# Altium schematic sheet ИМ 1301.10A.01.400_1.SchDoc
size 594 x 420 mm; ApprovedBy: Гришин; CheckedBy: Недвецкий; Author: Буй; Address1: Address1; Address2: Address2; Address3: Address3; Address4: Address4; DocumentNumber: ИМ 1301.10A.01.400 Э3; SheetNumber: 1; SheetTotal: 4; DocumentType: Схема электрическая принципиальная; T_cont: Варенов; Letter: Э
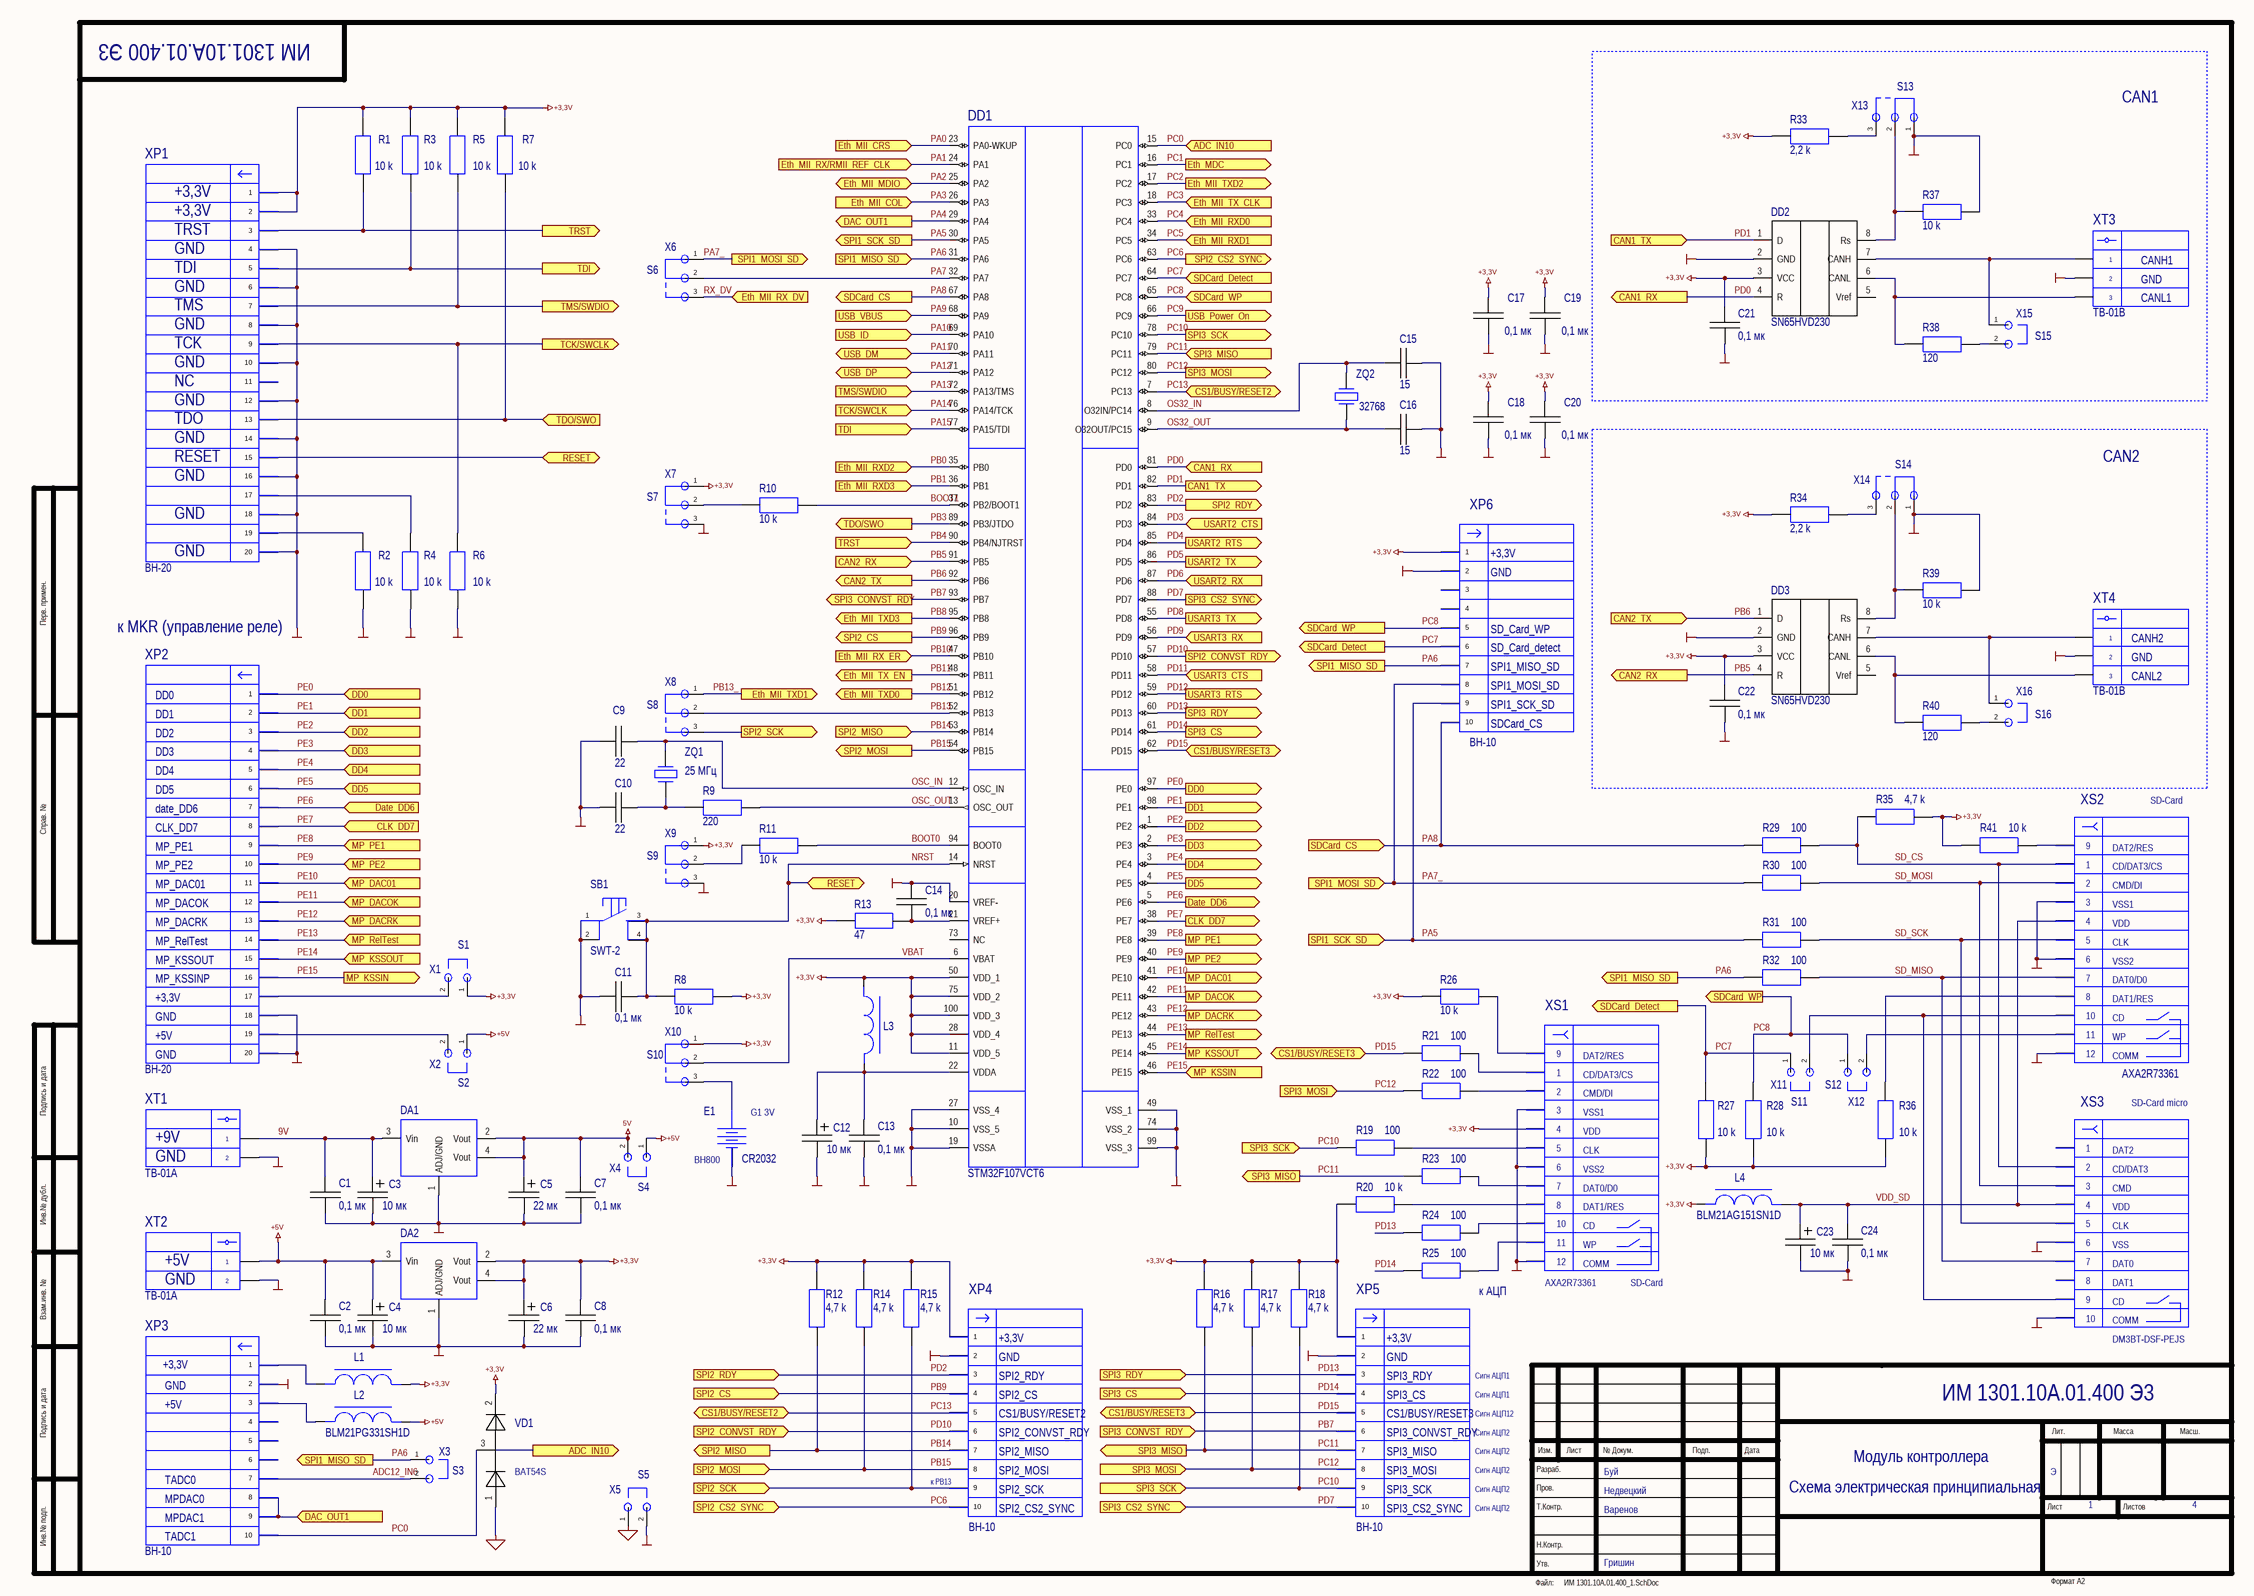
[diagram p0: ИМ 1301.10A.01.400_1.SchDoc]

## Parts
C1  0,1 мк  [CAPC_1206]
C2  0,1 мк  [CAPC_1206]
C3  10 мк  [3216]
C4  10 мк  [3216]
C5  22 мк  [3216]
C6  22 мк  [3216]
C7  0,1 мк  [CAPC_1206]
C8  0,1 мк  [CAPC_1206]
C9  22  [CAPC_1206]
C10  22  [CAPC_1206]
C11  0,1 мк  [CAPC_1206]
C12  10 мк  [3216]
C13  0,1 мк  [CAPC_1206]
C14  0,1 мк  [CAPC_1206]
C15  15  [CAPC_1206]
C16  15  [CAPC_1206]
C17  0,1 мк  [CAPC_1206]
C18  0,1 мк  [CAPC_1206]
C19  0,1 мк  [CAPC_1206]
C20  0,1 мк  [CAPC_1206]
C21  0,1 мк  [CAPC_1206]
C22  0,1 мк  [CAPC_1206]
C23  10 мк  [3216]
C24  0,1 мк  [CAPC_1206]
DA1  LM1117  [SOT223]  (value not drawn)
DA2  LM1117  [SOT223]  (value not drawn)
DD1  STM32F107VCT6  [LQFP100]
DD2  SN65HVD230  [SO8]
DD3  SN65HVD230  [SO8]
E1  BH800  value CR2032  G: G1 3V  [BATTERY_20mm]
L1  BLM21PG331SH1D  [C0805]  (value not drawn)
L2  BLM21PG331SH1D  [C0805]
L3  BLM21AG151SN1D  [C0805]  (value not drawn)
L4  BLM21AG151SN1D  [C0805]
R1  10 k  [SMD_1206]
R2  10 k  [SMD_1206]
R3  10 k  [SMD_1206]
R4  10 k  [SMD_1206]
R5  10 k  [SMD_1206]
R6  10 k  [SMD_1206]
R7  10 k  [SMD_1206]
R8  10 k  [SMD_1206]
R9  220  [SMD_1206]
R10  10 k  [SMD_1206]
R11  10 k  [SMD_1206]
R12  4,7 k  [SMD_1206]
R13  47  [SMD_1206]
R14  4,7 k  [SMD_1206]
R15  4,7 k  [SMD_1206]
R16  4,7 k  [SMD_1206]
R17  4,7 k  [SMD_1206]
R18  4,7 k  [SMD_1206]
R19  100  [SMD_1206]
R20  10 k  [SMD_1206]
R21  100  [SMD_1206]
R22  100  [SMD_1206]
R23  100  [SMD_1206]
R24  100  [SMD_1206]
R25  100  [SMD_1206]
R26  10 k  [SMD_1206]
R27  10 k  [SMD_1206]
R28  10 k  [SMD_1206]
R29  100  [SMD_1206]
R30  100  [SMD_1206]
R31  100  [SMD_1206]
R32  100  [SMD_1206]
R33  2,2 k  [SMD_1206]
R34  2,2 k  [SMD_1206]
R35  4,7 k  [SMD_1206]
R36  10 k  [SMD_1206]
R37  10 k  [SMD_1206]
R38  120  [SMD_1206]
R39  10 k  [SMD_1206]
R40  120  [SMD_1206]
R41  10 k  [SMD_1206]
SB1  SWT-2  [SWT2]
VD1  BAT54S  [SOT23]
X1  Jamper: S1  [PLS-2]  (hidden comment: PLS-02)
X2  Jamper: S2  [PLS-2]  (hidden comment: PLS-02)
X3  Jamper: S3  [PLS-2]  (hidden comment: PLS-02)
X4  Jamper: S4  [PLS-2]  (hidden comment: PLS-02)
X5  Jamper: S5  [PLS-2]  (hidden comment: PLS-02)
X6  Jamper: S6  [PLS-3]  (hidden comment: PLS-03)
X7  Jamper: S7  [PLS-3]  (hidden comment: PLS-03)
X8  Jamper: S8  [PLS-3]  (hidden comment: PLS-03)
X9  Jamper: S9  [PLS-3]  (hidden comment: PLS-03)
X10  Jamper: S10  [PLS-3]  (hidden comment: PLS-03)
X11  Jamper: S11  [PLS-2]  (hidden comment: PLS-02)
X12  Jamper: S12  [PLS-2]  (hidden comment: PLS-02)
X13  Jamper: S13  [PLS-3]  (hidden comment: PLS-03)
X14  Jamper: S14  [PLS-3]  (hidden comment: PLS-03)
X15  Jamper: S15  [PLS-2]  (hidden comment: PLS-02)
X16  Jamper: S16  [PLS-2]  (hidden comment: PLS-02)
XP1  BH-20  [PLD-20]
XP2  BH-20  [PLD-20]
XP3  BH-10  [PLD-10]
XP4  BH-10  [PLD-10]
XP5  BH-10  [PLD-10]
XP6  BH-10  [PLD-10]
XS1  AXA2R73361  Function: SD-Card  [SD_AXA2R]
XS2  AXA2R73361  Function: SD-Card  [SD_AXA2R]
XS3  DM3BT-DSF-PEJS  Function: SD-Card micro  [DM3BT-DSF-PEJS]
XT1  TB-01A  [TB-01A]
XT2  TB-01A  [TB-01A]
XT3  TB-01B  [TB-01B]
XT4  TB-01B  [TB-01B]
ZQ1  25 МГц  [HC-49U_5mm]
ZQ2  32768  [DT-38P]

## Blocks framed on the sheet
CAN1: C21 DD2 R33 R37 R38 X13 X15 XT3
CAN2: C22 DD3 R34 R39 R40 X14 X16 XT4

## Ports
ADC_IN10 (in), ADC_IN10 (out), CAN1_RX (in), CAN1_RX (out), CAN1_TX (in), CAN1_TX (out), CAN2_RX (in), CAN2_RX (out), CAN2_TX (in), CAN2_TX (out), CLK_DD7 (in), CLK_DD7 (out), CS1/BUSY/RESET2 (bidir), CS1/BUSY/RESET3 (bidir), DAC_OUT1 (in), DAC_OUT1 (out), Date_DD6 (in), Date_DD6 (out), DD0 (in), DD0 (out), DD1 (in), DD1 (out), DD2 (in), DD2 (out), DD3 (in), DD3 (out), DD4 (in), DD4 (out), DD5 (in), DD5 (out), Eth_MDC (out), Eth_MII_COL (in), Eth_MII_CRS (in), Eth_MII_MDIO (bidir), Eth_MII_RX/RMII_REF_CLK (in), Eth_MII_RX_DV (in), Eth_MII_RX_ER (in), Eth_MII_RXD0 (in), Eth_MII_RXD1 (in), Eth_MII_RXD2 (in), Eth_MII_RXD3 (in), Eth_MII_TX_CLK (in), Eth_MII_TX_EN (out), Eth_MII_TXD0 (out), Eth_MII_TXD1 (out), Eth_MII_TXD2 (out), Eth_MII_TXD3 (out), MP_DAC01 (in), MP_DAC01 (out), MP_DACOK (in), MP_DACOK (out), MP_DACRK (in), MP_DACRK (out), MP_KSSIN (in), MP_KSSIN (out), MP_KSSOUT (in), MP_KSSOUT (out), MP_PE1 (in), MP_PE1 (out), MP_PE2 (in), MP_PE2 (out), MP_RelTest (in), MP_RelTest (out), RESET (bidir), SDCard_CS (in), SDCard_CS (out), SDCard_Detect (in), SDCard_Detect (out), SDCard_WP (in), SDCard_WP (out), SPI1_MISO_SD (in), SPI1_MISO_SD (out), SPI1_MOSI_SD (in), SPI1_MOSI_SD (out), SPI1_SCK_SD (in), SPI1_SCK_SD (out), SPI2_CONVST_RDY (in), SPI2_CONVST_RDY (out), SPI2_CS2_SYNC (in), SPI2_CS2_SYNC (out), SPI2_CS (in), SPI2_CS (out), SPI2_MISO (in), SPI2_MISO (out), SPI2_MOSI (in), SPI2_MOSI (out), SPI2_RDY (in), SPI2_RDY (out), SPI2_SCK (in), SPI2_SCK (out), SPI3_CONVST_RDY (in), SPI3_CONVST_RDY (out), SPI3_CS2_SYNC (in), SPI3_CS2_SYNC (out), SPI3_CS (in), SPI3_CS (out), SPI3_MISO (in), SPI3_MISO (out), SPI3_MOSI (in), SPI3_MOSI (out), SPI3_RDY (in), SPI3_RDY (out), SPI3_SCK (in), SPI3_SCK (out), TCK/SWCLK (in), TCK/SWCLK (out), TDI (in), TDI (out), TDO/SWO (in), TDO/SWO (out), TMS/SWDIO (in), TMS/SWDIO (out), TRST (in), TRST (out), USART2_CTS (in), USART2_RTS (out), USART2_RX (in), USART2_TX (out), USART3_CTS (in), USART3_RTS (out), USART3_RX (in), USART3_TX (out), USB_DM (bidir), USB_DP (bidir), USB_ID (in), USB_Power_On (out), USB_VBUS (in)

## Nets
5V: C5.1(+) C7.1 DA1.2(Vout) DA1.4(Vout) X4.2
+3,3V: C6.1(+) C8.1 C17.1 C18.1 C19.1 C20.1 C21.1 C22.1 DA2.2(Vout) DA2.4(Vout) DD1.11(VDD_5) DD1.28(VDD_4) DD1.50(VDD_1) DD1.75(VDD_2) DD1.100(VDD_3) DD2.3(VCC) DD3.3(VCC) L1.2 L3.1 L4.1 R1.2 R3.2 R5.2 R7.2 R8.2 R12.2 R13.2 R14.2 R15.2 R16.2 R17.2 R18.2 R20.2 R26.1 R27.2 R28.2 R33.1 R34.1 R35.1 R36.2 R41.2 VD1.2(-) X1.1 X7.1 X9.1 X10.1 XP1.1 XP1.2 XP4.1 XP5.1 XP6.1 XS1.4
+5V: C2.1 C4.1(+) DA2.3(Vin) L2.2 X2.1 X4.1 XT2.1
AGND: VD1.1(+) X5.1
GND: C1.2 C2.2 C3.2(-) C4.2(-) C5.2(-) C6.2(-) C7.2 C8.2 C9.1 C10.1 C11.1 C12.2(-) C13.2 C14.1 C15.2 C16.2 C17.2 C18.2 C19.2 C20.2 C21.2 C22.2 C23.2(-) C24.2 DA1.1(ADJ/GND) DA2.1(ADJ/GND) DD1.10(VSS_5) DD1.19(VSSA) DD1.20(VREF-) DD1.27(VSS_4) DD1.49(VSS_1) DD1.74(VSS_2) DD1.99(VSS_3) DD2.2(GND) DD3.2(GND) E1.2 R2.1 R4.1 R6.1 R37.2 R39.2 SB1.1 SB1.2 X5.2 X7.3 X9.3 X13.1 X14.1 XP1.4 XP1.6 XP1.8 XP1.10 XP1.12 XP1.14 XP1.16 XP1.18 XP1.20 XP2.18 XP2.20 XP3.2 XP4.2 XP5.2 XP6.2 XS1.3 XS1.6 XS1.12 XS2.3 XS2.6 XS2.12 XS3.6 XS3.10 XT1.2 XT2.2 XT3.2 XT4.2
9V: C1.1 C3.1(+) DA1.3(Vin) XT1.1
ADC12_IN6: X3.2 XP3.7
BOOT0: DD1.94(BOOT0) R11.2
BOOT1: DD1.37(PB2/BOOT1) R10.2
NRST: C11.2 DD1.14(NRST) R8.1 SB1.3 SB1.4 XP1.15 ; port RESET
OS32_IN: C15.1 DD1.8(O32IN/PC14) ZQ2.1
OS32_OUT: C16.1 DD1.9(O32OUT/PC15) ZQ2.2
OSC_IN: C9.2 DD1.12(OSC_IN) ZQ1.2
OSC_OUT: DD1.13(OSC_OUT) R9.2
PA0: DD1.23(PA0-WKUP) ; port Eth_MII_CRS
PA1: DD1.24(PA1) ; port Eth_MII_RX/RMII_REF_CLK
PA2: DD1.25(PA2) ; port Eth_MII_MDIO
PA3: DD1.26(PA3) ; port Eth_MII_COL
PA4: DD1.29(PA4) XP3.8 XP3.9 ; port DAC_OUT1
PA5: DD1.30(PA5) R31.2 XP6.9 ; port SPI1_SCK_SD
PA6: DD1.31(PA6) R32.2 X3.1 XP6.7 ; port SPI1_MISO_SD
PA7: DD1.32(PA7) X6.2
PA7_: R30.2 X6.1 XP6.8 ; port SPI1_MOSI_SD
PA8: DD1.67(PA8) R29.2 XP6.10 ; port SDCard_CS
PA9: DD1.68(PA9) ; port USB_VBUS
PA10: DD1.69(PA10) ; port USB_ID
PA11: DD1.70(PA11) ; port USB_DM
PA12: DD1.71(PA12) ; port USB_DP
PA13: DD1.72(PA13/TMS) R5.1 XP1.7 ; port TMS/SWDIO
PA14: DD1.76(PA14/TCK) R6.2 XP1.9 ; port TCK/SWCLK
PA15: DD1.77(PA15/TDI) R3.1 XP1.5 ; port TDI
PB0: DD1.35(PB0) ; port Eth_MII_RXD2
PB1: DD1.36(PB1) ; port Eth_MII_RXD3
PB3: DD1.89(PB3/JTDO) R7.1 XP1.13 ; port TDO/SWO
PB4: DD1.90(PB4/NJTRST) R1.1 XP1.3 ; port TRST
PB5: DD1.91(PB5) DD3.4(R) ; port CAN2_RX
PB6: DD1.92(PB6) DD3.1(D) ; port CAN2_TX
PB7: DD1.93(PB7) XP5.6 ; port SPI3_CONVST_RDY
PB8: DD1.95(PB8) ; port Eth_MII_TXD3
PB9: DD1.96(PB9) XP4.4 ; port SPI2_CS
PB10: DD1.47(PB10) ; port Eth_MII_RX_ER
PB11: DD1.48(PB11) ; port Eth_MII_TX_EN
PB12: DD1.51(PB12) ; port Eth_MII_TXD0
PB13: DD1.52(PB13) X8.2
PB13_: X8.1 ; port Eth_MII_TXD1
PB14: DD1.53(PB14) R12.1 XP4.7 ; port SPI2_MISO
PB15: DD1.54(PB15) R14.1 XP4.8 ; port SPI2_MOSI
PC0: DD1.15(PC0) VD1.3 XP3.10 ; port ADC_IN10
PC1: DD1.16(PC1) ; port Eth_MDC
PC2: DD1.17(PC2) ; port Eth_MII_TXD2
PC3: DD1.18(PC3) ; port Eth_MII_TX_CLK
PC4: DD1.33(PC4) ; port Eth_MII_RXD0
PC5: DD1.34(PC5) ; port Eth_MII_RXD1
PC6: DD1.63(PC6) XP4.10 ; port SPI2_CS2_SYNC
PC7: DD1.64(PC7) R27.1 X11.1 XP6.6 ; port SDCard_Detect
PC8: DD1.65(PC8) R28.1 X12.1 XP6.5 ; port SDCard_WP
PC9: DD1.66(PC9) ; port USB_Power_On
PC10: DD1.78(PC10) R18.1 R19.2 XP5.9 ; port SPI3_SCK
PC11: DD1.79(PC11) R16.1 R23.2 XP5.7 ; port SPI3_MISO
PC12: DD1.80(PC12) R17.1 R22.2 XP5.8 ; port SPI3_MOSI
PC13: DD1.7(PC13) XP4.5 ; port CS1/BUSY/RESET2
PD0: DD1.81(PD0) DD2.4(R) ; port CAN1_RX
PD1: DD1.82(PD1) DD2.1(D) ; port CAN1_TX
PD2: DD1.83(PD2) XP4.3 ; port SPI2_RDY
PD3: DD1.84(PD3) ; port USART2_CTS
PD4: DD1.85(PD4) ; port USART2_RTS
PD5: DD1.86(PD5) ; port USART2_TX
PD6: DD1.87(PD6) ; port USART2_RX
PD7: DD1.88(PD7) XP5.10 ; port SPI3_CS2_SYNC
PD8: DD1.55(PD8) ; port USART3_TX
PD9: DD1.56(PD9) ; port USART3_RX
PD10: DD1.57(PD10) XP4.6 ; port SPI2_CONVST_RDY
PD11: DD1.58(PD11) ; port USART3_CTS
PD12: DD1.59(PD12) ; port USART3_RTS
PD13: DD1.60(PD13) R24.2 XP5.3 ; port SPI3_RDY
PD14: DD1.61(PD14) R25.2 XP5.4 ; port SPI3_CS
PD15: DD1.62(PD15) R21.2 XP5.5 ; port CS1/BUSY/RESET3
PE0: DD1.97(PE0) XP2.1 ; port DD0
PE1: DD1.98(PE1) XP2.2 ; port DD1
PE2: DD1.1(PE2) XP2.3 ; port DD2
PE3: DD1.2(PE3) XP2.4 ; port DD3
PE4: DD1.3(PE4) XP2.5 ; port DD4
PE5: DD1.4(PE5) XP2.6 ; port DD5
PE6: DD1.5(PE6) XP2.7 ; port Date_DD6
PE7: DD1.38(PE7) XP2.8 ; port CLK_DD7
PE8: DD1.39(PE8) XP2.9 ; port MP_PE1
PE9: DD1.40(PE9) XP2.10 ; port MP_PE2
PE10: DD1.41(PE10) XP2.11 ; port MP_DAC01
PE11: DD1.42(PE11) XP2.12 ; port MP_DACOK
PE12: DD1.43(PE12) XP2.13 ; port MP_DACRK
PE13: DD1.44(PE13) XP2.14 ; port MP_RelTest
PE14: DD1.45(PE14) XP2.15 ; port MP_KSSOUT
PE15: DD1.46(PE15) XP2.16 ; port MP_KSSIN
RX_DV: X6.3 ; port Eth_MII_RX_DV
SD_CS: R29.1 R35.2 XS2.1 XS3.2
SD_MISO: R32.1 XS2.7 XS3.7
SD_MOSI: R30.1 XS2.2 XS3.3
SD_SCK: R31.1 XS2.5 XS3.5
SPI2_SCK: R15.1 X8.3 XP4.9 ; port SPI2_SCK
VBAT: DD1.6(VBAT) X10.2
VDD_SD: C23.1(+) C24.1 L4.2 XS2.4 XS3.4
NetC10_2: C10.2 R9.1 ZQ1.1
NetC12_1: C12.1(+) C13.1 DD1.22(VDDA) L3.2
NetC14_2: C14.2 DD1.21(VREF+) R13.1
NetDD2_6: DD2.6(CANL) R38.1 XT3.3
NetDD2_7: DD2.7(CANH) X15.1 XT3.1
NetDD2_8: DD2.8(Rs) R37.1 X13.2
NetDD3_6: DD3.6(CANL) R40.1 XT4.3
NetDD3_7: DD3.7(CANH) X16.1 XT4.1
NetDD3_8: DD3.8(Rs) R39.1 X14.2
NetE1_1: E1.1 X10.3
NetL1_1: L1.1 XP3.1
NetL2_1: L2.1 XP3.3
NetR2_2: R2.2 XP1.19
NetR4_2: R4.2 XP1.17
NetR10_1: R10.1 X7.2
NetR11_1: R11.1 X9.2
NetR19_1: R19.1 XS1.5
NetR20_1: R20.1 XS1.8
NetR21_1: R21.1 XS1.1
NetR22_1: R22.1 XS1.2
NetR23_1: R23.1 XS1.7
NetR24_1: R24.1 XS1.10
NetR25_1: R25.1 XS1.11
NetR26_2: R26.2 XS1.9
NetR33_2: R33.2 X13.3
NetR34_2: R34.2 X14.3
NetR36_1: R36.1 XS2.8
NetR38_2: R38.2 X15.2
NetR40_2: R40.2 X16.2
NetR41_1: R41.1 XS2.9
NetX1_2: X1.2 XP2.17
NetX2_2: X2.2 XP2.19
NetX11_2: X11.2 XS2.10 XS3.9
NetX12_2: X12.2 XS2.11

Not connected (* = marked no-connect by the designer): DD1 73(NC); DD2 5(Vref); DD3 5(Vref); XP1 11; XP3 4 5 6; XP6 3 4; XS3 1 8

## Notes on the sheet
- +3,3V
- TRST
- GND
- CANH1
- TDI
- TMS
- CANL1
- TCK
- NC
- TDO
- RESET
- (near XP6) +3,3V
- (near XP6) GND
- к MKR (управление реле)
- (near XP6) SD_Card_WP
- (near XT4) CANH2
- DD0
- (near XP6) SPI1_MOSI_SD
- (near XP6) SPI1_MISO_SD
- (near XP6) SD_Card_detect
- (near XT4) GND
- (near XT4) CANL2
- DD1
- DD2
- (near XP6) SPI1_SCK_SD
- (near XP6) SDCard_CS
- DD3
- DD4
- DD5
- date_DD6
- CLK_DD7
- MP_PE1
- MP_PE2
- MP_DAC01
- MP_DACOK
- MP_DACRK
- MP_KSSINP
- MP_RelTest
- MP_KSSOUT
- +5V
- +9V
- (near R25) к АЦП
- (near XP4) +3,3V
- (near XP4) GND
- (near XP5) +3,3V
- (near XP5) GND
- (near XP4) CS1/BUSY/RESET2
- (near XP4) SPI2_CS
- (near XP4) SPI2_RDY
- (near XP5) CS1/BUSY/RESET3
- (near XP5) SPI3_CS
- (near XP5) SPI3_RDY
- Сигн АЦП1
- Сигн АЦП12
- (near XP4) SPI2_MISO
- (near XP4) SPI2_CONVST_RDY
- (near XP5) SPI3_MISO
- (near XP5) SPI3_CONVST_RDY
- Сигн АЦП2
- Модуль контроллера
- MPDAC0
- TADC0
- (near XP4) к PB13
- (near XP4) SPI2_SCK
- (near XP4) SPI2_MOSI
- (near XP4) SPI2_CS2_SYNC
- (near XP5) SPI3_SCK
- (near XP5) SPI3_MOSI
- (near XP5) SPI3_CS2_SYNC
- Схема электрическая принципиальная
- MPDAC1
- TADC1
- Перв. примен.
- Справ. №
- Подпись и дата
- Инв.№ дубл.
- Взам.инв. №
- Разраб.
- Изм.
- Лист
- № Докум.
- Подп.
- Дата
- Лит.
- Масса
- Масш.
- Пров.
- Т.Контр.
- Листов
- Инв.№ подп.
- Утв.
- Н.Контр.
- Файл:
- Формат А2
- (in symbol MicroSD) DAT2; CD/DAT3; CMD; VDD; CLK; VSS; DAT0; DAT1; CD; COMM
- (in symbol SDcard) DAT2/RES; CD/DAT3/CS; CMD/DI; VSS1; VDD; CLK; VSS2; DAT0/D0; DAT1/RES; CD; WP; COMM

## Library data of the parts
C1 C2 C7-C11 C13-C22 C24 = C: Capasitor; MarkPCB: *; Name: *
  C1 C2 C7 C8 C13 C14 C17-C22 C24: ValueSCH: 0,1 мк; Part Number: C; Component Kind: Standard; Component Type: Standard; Designator: C; Footprint: K73-17; Pin Count: 2
  C9 C10: ValueSCH: 22
  C11: ValueSCH: 0,1 мк
  C15 C16: ValueSCH: 15
C3-C6 C12 C23 = CapPol: Capasitor_polar; Part Number: CapPol; Component Kind: Standard; Component Type: Standard; Designator: CapPol; Footprint: CapPolar; Pin Count: 2
  C3 C4 C12 C23: ValueSCH: 10 мк
  C5 C6: ValueSCH: 22 мк
DA1 DA2 = LM1117: Positive voltage regulators; Manufacturer: National Semiconductor; Корпус: SOT-223; ComponentLink1Description: Параметры; ComponentLink2Description: Сайт производителя; ComponentLink2URL: *; ManufacturerPartNumber: LM1117; Power\Voltage: *; Rem: *; TKE: *; Tolerance: *; TU/GOST: *; Value: *; Примечание: *; Mark: *
DD1 = STM32F107VCT6: STM32 ARM-based 32-bit MCU with 256 Kbytes Flash, 100-pin LQFP, Industrial Temperature; Published: 30-May-2008; DatasheetVersion: rev6, Mar-2008; PackageVersion: Mar-2008; PackageReference: LQFP100; Publisher: Altium Limited; PackageDescription: 100-Pin Low-Profile Quad Flat Pack, 14 x 14 mm Body, 0.5 mm Pitch (LQFP100); ComponentLink1Description: Manufacturer Link; ComponentLink1URL: www.st.com/stm32; ComponentLink2Description: Datasheet; ComponentLink2URL: http://www.st.com/stonline/products/literature/ds/13587.pdf
DD2 DD3 = SN65HVD230: CAN transceivers; Firma: Texas Instruments; Firma1: MAXIM; MARK1: MAX3051ESA+; Mark: SN65HVD230
E1 = BH800: Firma: OEM; Mark: BH800
L1-L4 = B: Ferrite bead; datasheet: *
  L1 L2: Value: BLM21PG331SH1D
  L3 L4: Value: BLM21AG151SN1D
R1-R41 = R_Gost: Resistor,2 Pin; ValueBOM: *; MarkPCB: *
  R1-R8 R10 R11 R20 R26-R28 R36 R37 R39 R41: ValueSCH: 10 k
  R9: ValueSCH: 220
  R12 R14-R18 R35: ValueSCH: 4,7 k
  R13: ValueSCH: 47
  R19 R21-R25 R29-R32: ValueSCH: 100
  R33 R34: ValueSCH: 2,2 k
  R38 R40: ValueSCH: 120
SB1 = SWT-2: SWT-2, key; Value: SWT-2
VD1 = BS40-04: Diod Schottky, 3 pin; Manufacturer: Fairchild; Mark: BS40-04; ComponentLink1Description: Параметры; ComponentLink2Description: Сайт производителя; ComponentLink1URL: D\datasheet\BAT54.pdf; ComponentLink2URL: *; ManufacturerPartNumber: BAT54S; Power\Voltage: *; Rem: *; TKE: *; Tolerance: *; TU/GOST: *; Value: *; Примечание: *
X1-X5 X11 X12 X15 X16 = J2: Value: PLS-02
X6-X10 X13 X14 = J3: Value: PLS-03
XS1 XS2 = SDcard: SD-card socket; Firma: Honda Connectors; Firma1: Panasonic Electric; Value: AXA2R73361
XS3 = MicroSD: SD-card socket; Value: DM3AT-SF-PEJM5; Firma: Hirose; Value1: DM3BT-DSF-PEJS
ZQ1 ZQ2 = OSC
  ZQ1: Value: 25 МГц
  ZQ2: Value: 32768
XP1 XP2 = BH-20: Value: BH-20
XP3-XP6 = BH-10: Value: BH-10
XT1 XT2 = TB-01A: Name: TB-01A
XT3 XT4 = TB-01B: Name: TB-01B